# EAGLE design touch_rev2 (EAGLE 6.5.0)
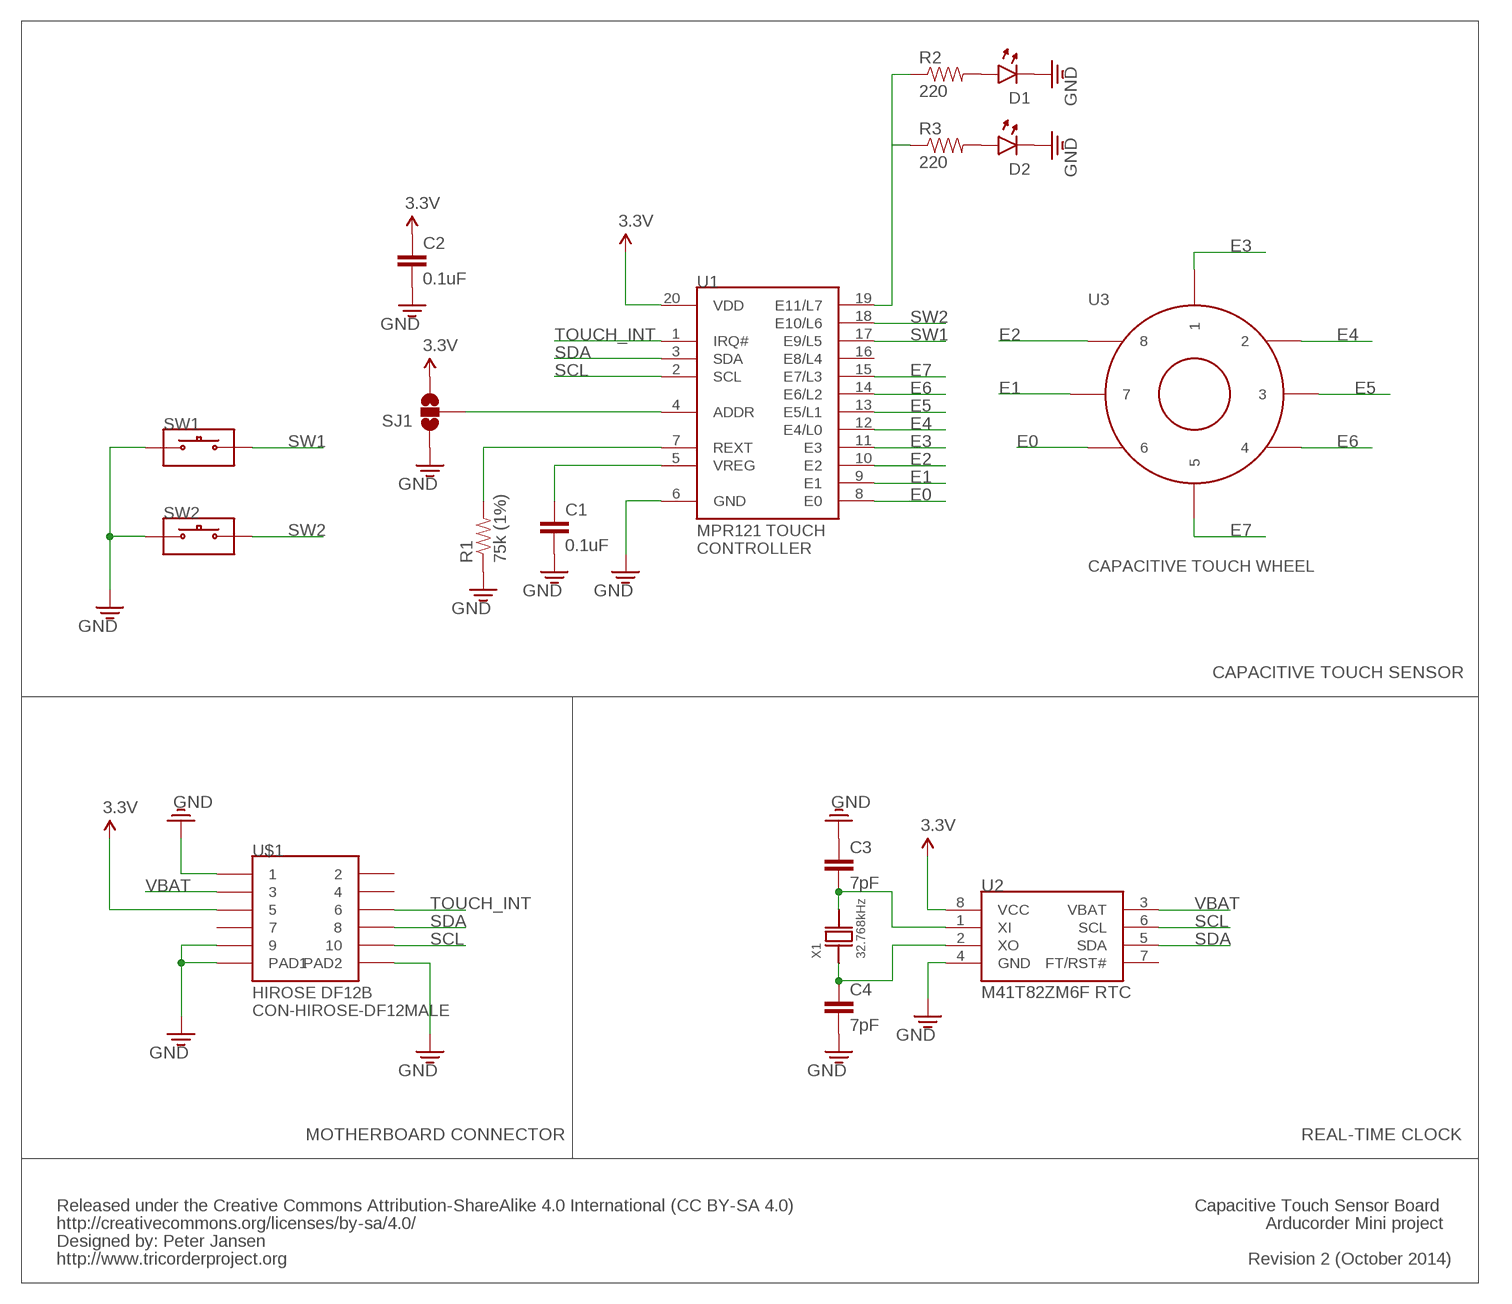
[diagram p0: schematic, sheet 1]

## Parts
C1  0.1uF  CAP0603  [0603]
C2  0.1uF  CAP0603  [0603]
C3  7pF  CAP0603  [0603]
C4  7pF  CAP0603  [0603]
D1  0605-LED  [0603-LED]
D2  0605-LED  [0603-LED]
R1  75k (1%)  RESISTOR0603  [0603]
R2  220  RESISTOR0603  [0603]
R3  220  RESISTOR0603  [0603]
SJ1  SOLDERJUMPER_2WAYPASTE1&2  [SJ_3_PASTE1&2]
SW1  SWITCH  [KMT071]
SW2  SWITCH  [KMT071]
U1  MPR121-TOUCH-CONTROLLER  [QFN-3X3-20]
U2  M41T82ZM6F  [8-SOIC]
U3  CAPACITIVE-WHEEL-8  [CAPACITIVE-WHEEL-8]
U$1  CON-HIROSE-DF12MALE  [DF12B(3.0)-10DS-0.5V(86)]
X1  32.768kHz  CRYSTAL  [CRYSTAL-9HT10]

## Nets
3.3V: C2.1 SJ1.3 U1.20(VDD) U2.8(VCC) U$1.5
E0: U1.8(E0) U3.6
E1: U1.9(E1) U3.7
E2: U1.10(E2) U3.8
E3: U1.11(E3) U3.1
E4: U1.12(E4/L0) U3.2
E5: U1.13(E5/L1) U3.3
E6: U1.14(E6/L2) U3.4
E7: U1.15(E7/L3) U3.5
GND: C1.2 C2.2 C3.1 C4.2 D1.CATHODE D2.CATHODE R1.1 SJ1.1 SW1.1A SW2.1A U1.6(GND) U2.4(GND) U$1.1 U$1.9 U$1.PAD1 U$1.PAD2
N$1: D1.ANODE R2.2
N$2: D2.ANODE R3.2
N$3: C1.1 U1.5(VREG)
N$4: R1.2 U1.7(REXT)
N$5: SJ1.2 U1.4(ADDR)
N$6: R2.1 R3.1 U1.19(E11/L7)
N$7: C4.1 U2.2(XO) X1.1
N$8: C3.2 U2.1(XI) X1.2
SCL: U1.2(SCL) U2.6(SCL) U$1.10
SDA: U1.3(SDA) U2.5(SDA) U$1.8
SW1: SW1.2A U1.17(E9/L5)
SW2: SW2.2A U1.18(E10/L6)
TOUCH_INT: U1.1(IRQ#) U$1.6
VBAT: U2.3(VBAT) U$1.3
Unconnected: U1.16(E8/L4) U2.7(FT/RST#) U$1.2 U$1.4 U$1.7

## Notes on the sheet
- CAPACITIVE TOUCH SENSOR
- MOTHERBOARD CONNECTOR | REAL-TIME CLOCK
- Released under the Creative Commons Attribution-ShareAlike 4.0 International (CC BY-SA 4.0) | Capacitive Touch Sensor Board
- http://creativecommons.org/licenses/by-sa/4.0/ | Arducorder Mini project
- Designed by: Peter Jansen
- http://www.tricorderproject.org | Revision 2 (October 2014)

## Library data of the parts
C1-C4 = notes_mark5a:CAP: Capacitor Standard 0603 ceramic capacitor, and 0.1" leaded capacitor.
D1 D2 = notes_mark5a1:0605-LED
R1-R3 = notes_mark5a1:RESISTOR: Resistor Basic schematic elements and footprints for 0603, 1206, and PTH 1/10th watt (small) resistors.
SJ1 = SparkFun-Passives:SOLDERJUMPER_2WAY: Solder Jumper 2 way solder jumper
SW1 SW2 = notes-arducorder-mini:SWITCH
U1 = notes-arducorder-mini:MPR121-TOUCH-CONTROLLER: MPR121 Capacitive Touch Controller
U2 = notes_mark5a:M41T82ZM6F: ST Electronics M41T82 Real-time clock (RTC) with Serial I2C interface and battery switchover
U3 = notes-arducorder-mini:CAPACITIVE-WHEEL-8
U$1 = arducorder-mini:CON-HIROSE-DF12
X1 = notes_mark5a:CRYSTAL

## Board
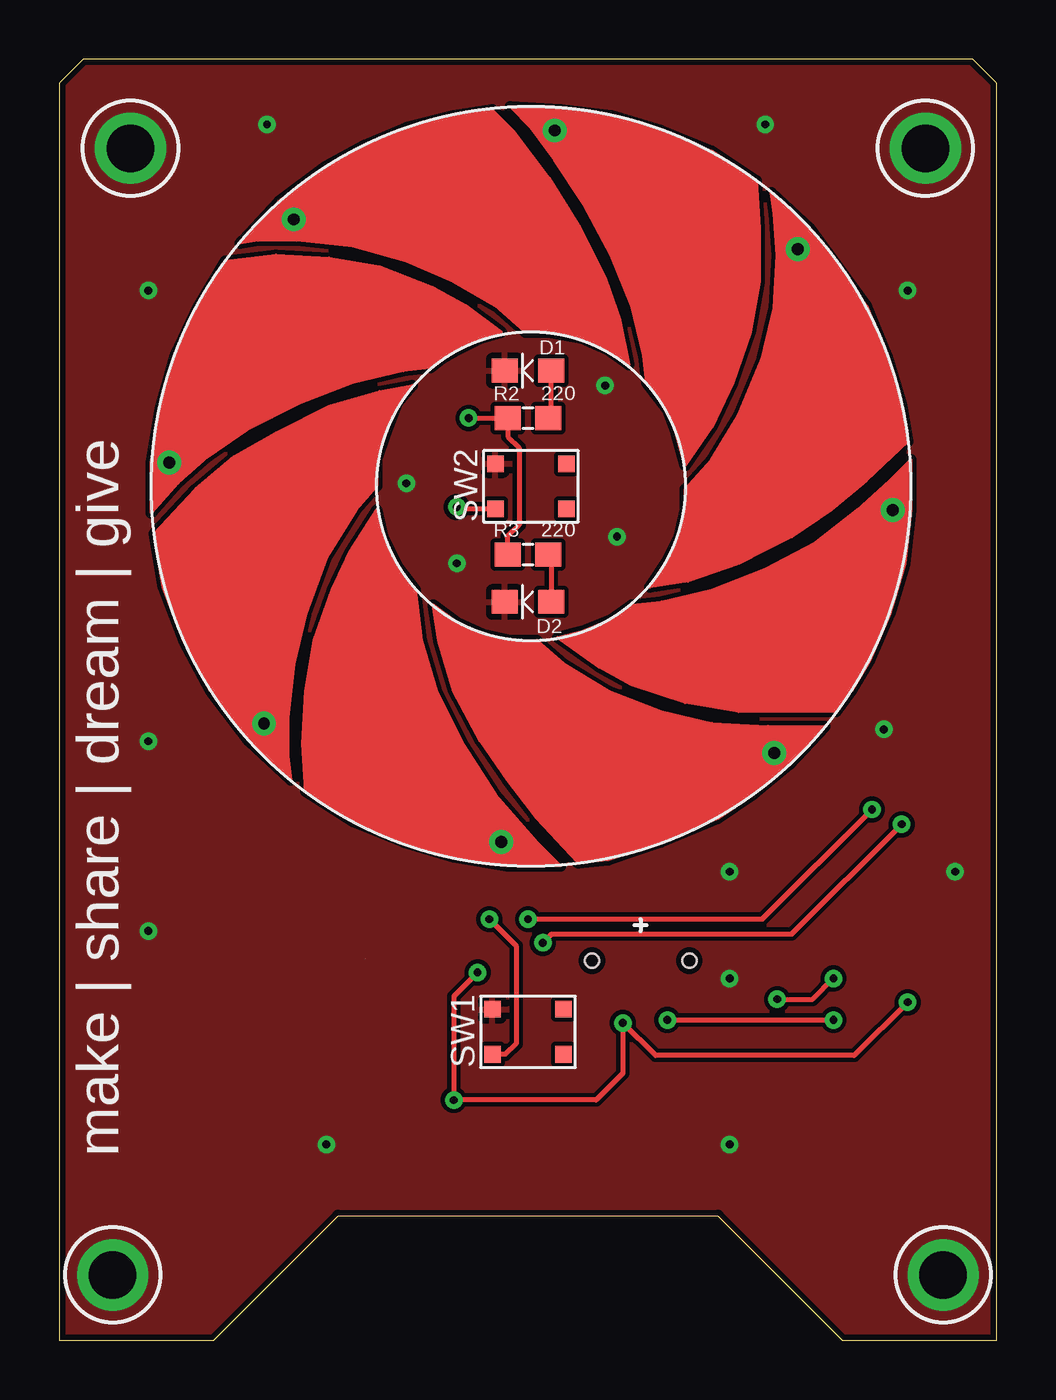
[diagram p1: board, top side]
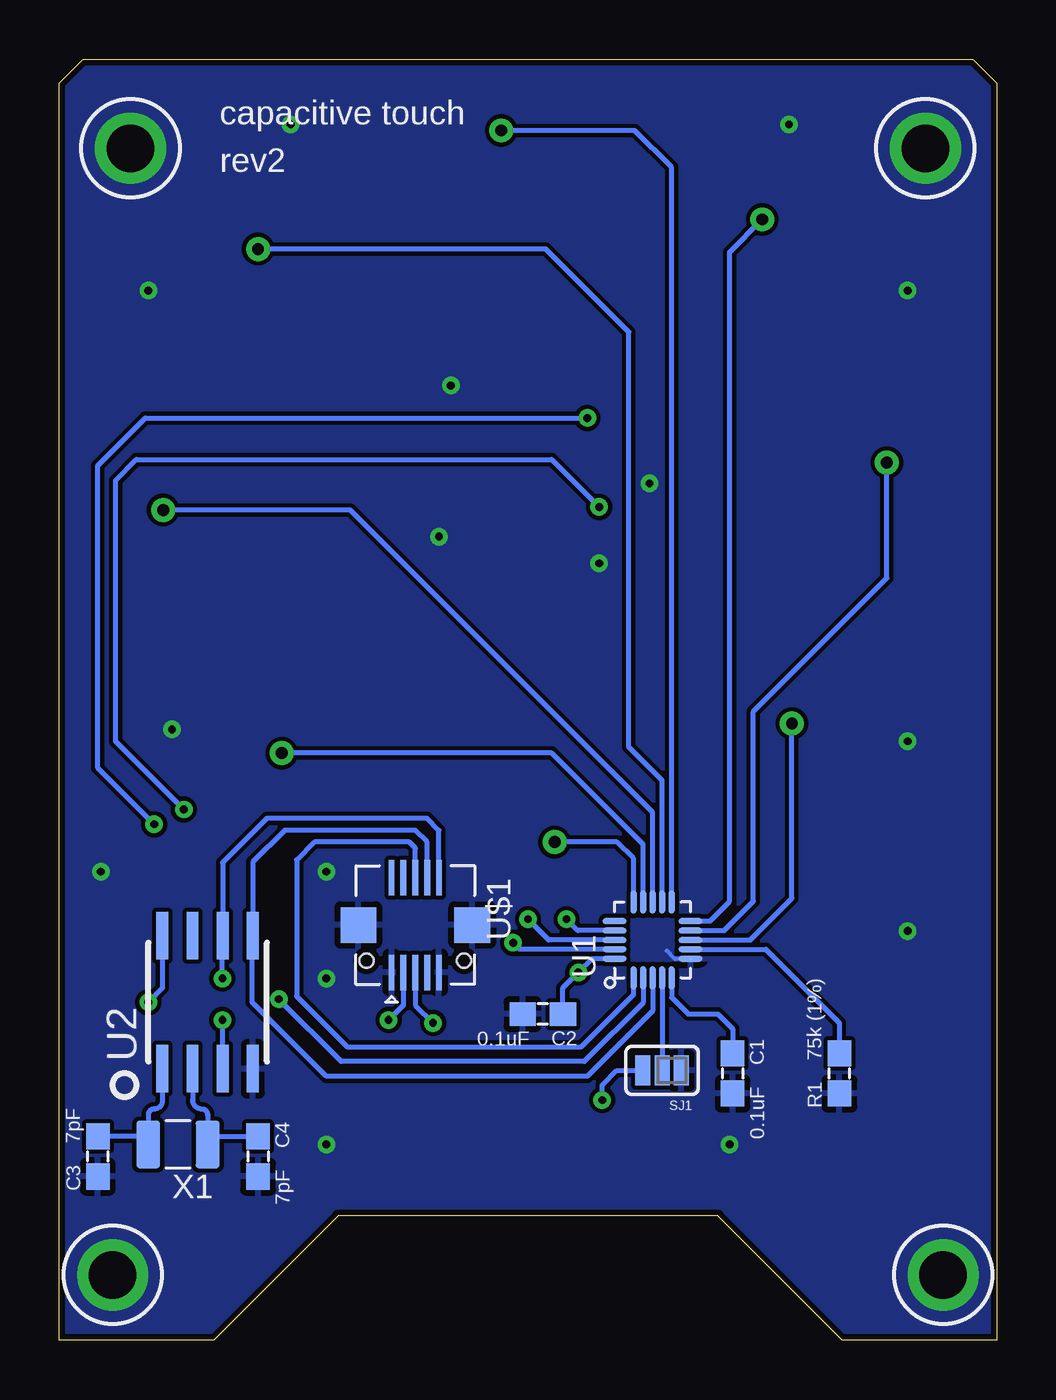
[diagram p2: board, bottom side, seen from below]

Size 39.5 x 54 mm. Coordinates in mm from the lower left corner, seen from the top.
Outline: 0,0 6.5,0 11.75,5.25 27.75,5.25 33,0 39.5,0 39.5,53 38.5,54 1,54 0,53 0,0
Copper layers (1*16): Top 0.035mm / dielectric 1.5mm / Bottom 0.035mm
Design rules "default *": minimum track width 7mil, minimum drill 13mil, track to track 7mil, track to pad 7mil, pad to pad 6mil, via to via 7mil, smd to smd 7mil, copper to edge 10mil, drill to drill 8mil, minimum pad ring 10mil, minimum via ring 8mil, stop-mask expansion 4mil, vias tented up to drill 0mil, thermal gap 10mil
bKeepout: area 2.8,16.2 to 10.8,22.2; area 4.8,22.8 to 20.2,35.8

### Footprints (pad centres in the part's own frame; a part is rotated, then mirrored left to right if it is on the bottom)
0603 = smd 1.1 x 1: 1 -0.85,0; 2 0.85,0
0603-LED = smd 1.1 x 1: ANODE -0.975,0; CATHODE 0.975,0
SJ_3_PASTE1&2 = smd 0.635 x 1.27: 1 -0.813,0; 2 0,0; 3 0.813,0
KMT071 = smd 0.7 x 0.7: 1A -1.5,0.95; 1B 1.5,0.95; 2A -1.5,-0.95; 2B 1.5,-0.95
QFN-3X3-20 = smd 1 x 0.25: 1 -1.6,0.8; 2 -1.6,0.4; 3 -1.6,0; 4 -1.6,-0.4; 5 -1.6,-0.8; 11 1.6,-0.8; 12 1.6,-0.4; 13 1.6,0; 14 1.6,0.4; 15 1.6,0.8 | smd 0.25 x 1: 6 -0.8,-1.6; 7 -0.4,-1.6; 8 0,-1.6; 9 0.4,-1.6; 10 0.8,-1.6; 16 0.8,1.6; 17 0.4,1.6; 18 0,1.6; 19 -0.4,1.6; 20 -0.8,1.6
8-SOIC = smd 2 x 0.5: 1 -2.81,1.905; 2 -2.81,0.635; 3 -2.81,-0.635; 4 -2.81,-1.905; 5 2.81,-1.905; 6 2.81,-0.635; 7 2.81,0.635; 8 2.81,1.905
CAPACITIVE-WHEEL-8 = drill 0.5: 1 1,15; 2 11.25,10; 3 15.25,-1; 4 10.25,-11.25; 5 -1.25,-15; 6 -11.25,-10; 7 -15.25,1; 8 -10,11.25
DF12B(3.0)-10DS-0.5V(86) = smd 0.25 x 1.5 bottom: 1 -1,2; 2 -1,-2; 3 -0.5,2; 4 -0.5,-2; 5 0,2; 6 0,-2; 7 0.5,2; 8 0.5,-2; 9 1,2; 10 1,-2 | smd 1.5 x 1.5 bottom: PAD1 -2.4,0; PAD2 2.4,0 | hole 0.6: 2.05,1.5; -2.05,1.5
CRYSTAL-9HT10 = smd 1 x 2: 1 -1.25,0; 2 1.25,0

### Placement (x,y rotation side)
C1  11.12,11.25 270 bottom
C2  19.12,13.75 180 bottom
C3  37.88,7.75 90 bottom
C4  31.12,7.75 270 bottom
D1  19.75,40.88 180 top
D2  19.75,31.12 180 top
R1  6.62,11.25 90 bottom
R2  19.75,38.88 0 top
R3  19.75,33.12 0 top
SJ1  14.1,11.38 180 bottom
SW1  19.75,13 0 top
SW2  19.88,36 0 top
U1  14.5,16.88 90 bottom
U2  33.25,14.25 90 bottom
U3  19.88,36 0 top
U$1  24.5,17.5 180 top
X1  34.5,8.25 180 bottom

### Tracks (layer width: path | path; a pad name or v marks a point on that pad's centre or on a via)
3.3V  (via drill 0.33)
  Top 0.203: v17.62,15.5 16.62,14.5 v16.62,10.12 22.62,10.12 23.75,11.25 v23.75,13.38 25.12,12 33.5,12 v35.75,14.25
  Bottom 0.203: U$1.5 24.5,14.12 v23.75,13.38 | v16.62,10.12 16.62,10.75 16,11.38 SJ1.3 | U1.20 17.05,16.07 v17.62,15.5 18.28,14.85 C2.1 | U2.8 35.16,14.84 v35.75,14.25
E0
  Bottom 0.203: U1.8 10.38,16.88 8.62,18.62 U3.6
E1
  Bottom 0.203: U1.9 12.88,17.27 11.48,17.27 10.25,18.5 10.25,26.5 4.62,32.12 U3.7
E2
  Bottom 0.203: U1.10 12.08,17.68 11.25,18.5 11.25,45.88 U3.8
E3
  Bottom 0.203: U1.11 13.7,49.45 15.25,51 U3.1
E4
  Bottom 0.203: U1.12 14.1,23.6 15.5,25 15.5,42.5 19,46 U3.2
E5
  Bottom 0.203: U1.13 14.5,22.25 27.25,35 U3.3
E6
  Bottom 0.203: U1.14 14.9,20.9 18.75,24.75 U3.4
E7
  Bottom 0.203: U1.15 15.3,20.3 16,21 U3.5
GND  (via drill 0.33, 2)  (1 unrouted)
  Bottom 0.178: U1.6 13.55,16.07 13.91,16.42
  other vias: 2.25,2.75 37.25,2.75 36.5,50.25 3,50.25 23.5,33.88 23,40.25 16.75,32.75 14.62,36.12 3.75,44.25 8.75,51.25 29.75,51.25 35.75,44.25 11.25,8.25 28.25,8.25 3.75,17.25 3.75,25.25 37.75,19.75 34.75,25.75 28.25,19.75 28.25,15.25
  pour Bottom (rank 4): 39.25,0.25 0.25,0.25 0.25,52.75 1.25,53.75 38.25,53.75 39.25,52.75
  pour Top (rank 4): 39.25,0.25 0.25,0.25 0.25,52.75 1.25,53.75 38.25,53.75 39.25,52.75
N$1
  Top 0.203: R2.2 20.72,39 D1.ANODE
N$2
  Top 0.203: R3.2 20.72,33 D2.ANODE
N$3
  Bottom 0.203: U1.5 13.7,14.45 13,13.75 11.75,13.75 11.12,13.12 C1.1
N$4
  Bottom 0.203: U1.7 9.73,16.48 6.62,13.38 R1.2
N$5
  Bottom 0.203: U1.4 SJ1.2
N$6  (via drill 0.33)
  Top 0.203: v20.38,16.75 20.75,17.12 30.88,17.12 v35.5,21.75 | v17.25,38.88 R2.1 18.9,38.1 19.38,37.62 19.38,34.38 18.88,33.88 18.88,33.15 R3.1
  Bottom 0.203: U1.19 20.1,16.48 v20.38,16.75 | v35.5,21.75 37.88,24.12 37.88,36.88 35.88,38.88 v17.25,38.88
N$7
  Bottom 0.203: U2.2 33.89,10.13 arc-90 33.5,9.75 arc90 33.25,9.5 X1.1 32.9,8.6 C4.1
N$8
  Bottom 0.203: U2.1 35.16,10.1 arc90 35.5,9.75 arc-90 35.75,9.5 X1.2 36.1,8.6 C3.2
SCL  (via drill 0.33)
  Top 0.203: v30.25,14.38 31.75,14.38 v32.62,15.25
  Bottom 0.203: U$1.10 23.5,21.5 24,22 30.75,22 32.61,20.14 U2.6 32.62,17.05 v32.62,15.25 | U1.2 14.9,14.23 17.38,11.75 27.62,11.75 v30.25,14.38
SDA
  Bottom 0.203: U$1.8 24,21 24.5,21.5 30,21.5 31.34,20.16 U2.5 31.38,17.03 31.38,14.25 28.25,11.12 17.25,11.12 14.5,13.88 U1.3
SW1  (via drill 0.33)
  Top 0.203: v18.12,17.75 19.25,16.62 19.25,12.5 18.8,12.05 SW1.2A
  Bottom 0.203: U1.17 17.65,17.27 v18.12,17.75
SW2  (via drill 0.33)
  Top 0.203: v19.75,17.75 29.62,17.75 v34.25,22.38 | v16.75,35.12 16.83,35.05 SW2.2A
  Bottom 0.203: U1.18 18.88,16.88 v19.75,17.75 | v34.25,22.38 37.12,25.25 37.12,36.25 36.25,37.12 18.75,37.12 v16.75,35.12
TOUCH_INT
  Bottom 0.203: U$1.6 24.5,20.75 24.75,21 28.75,21 29.5,20.25 29.5,14.5 27.38,12.38 17.5,12.38 15.3,14.57 U1.1
VBAT  (via drill 0.33)
  Top 0.203: v25.62,13.5 v32.62,13.5
  Bottom 0.203: U$1.3 25,14.12 v25.62,13.5 | v32.62,13.5 32.62,11.45 U2.3

### Text on the board
tPlace: make | share | dream | give
bPlace: capacitive touch | rev2